# EAGLE design X15-ESC-CONTROLLER (EAGLE 9.6.2)
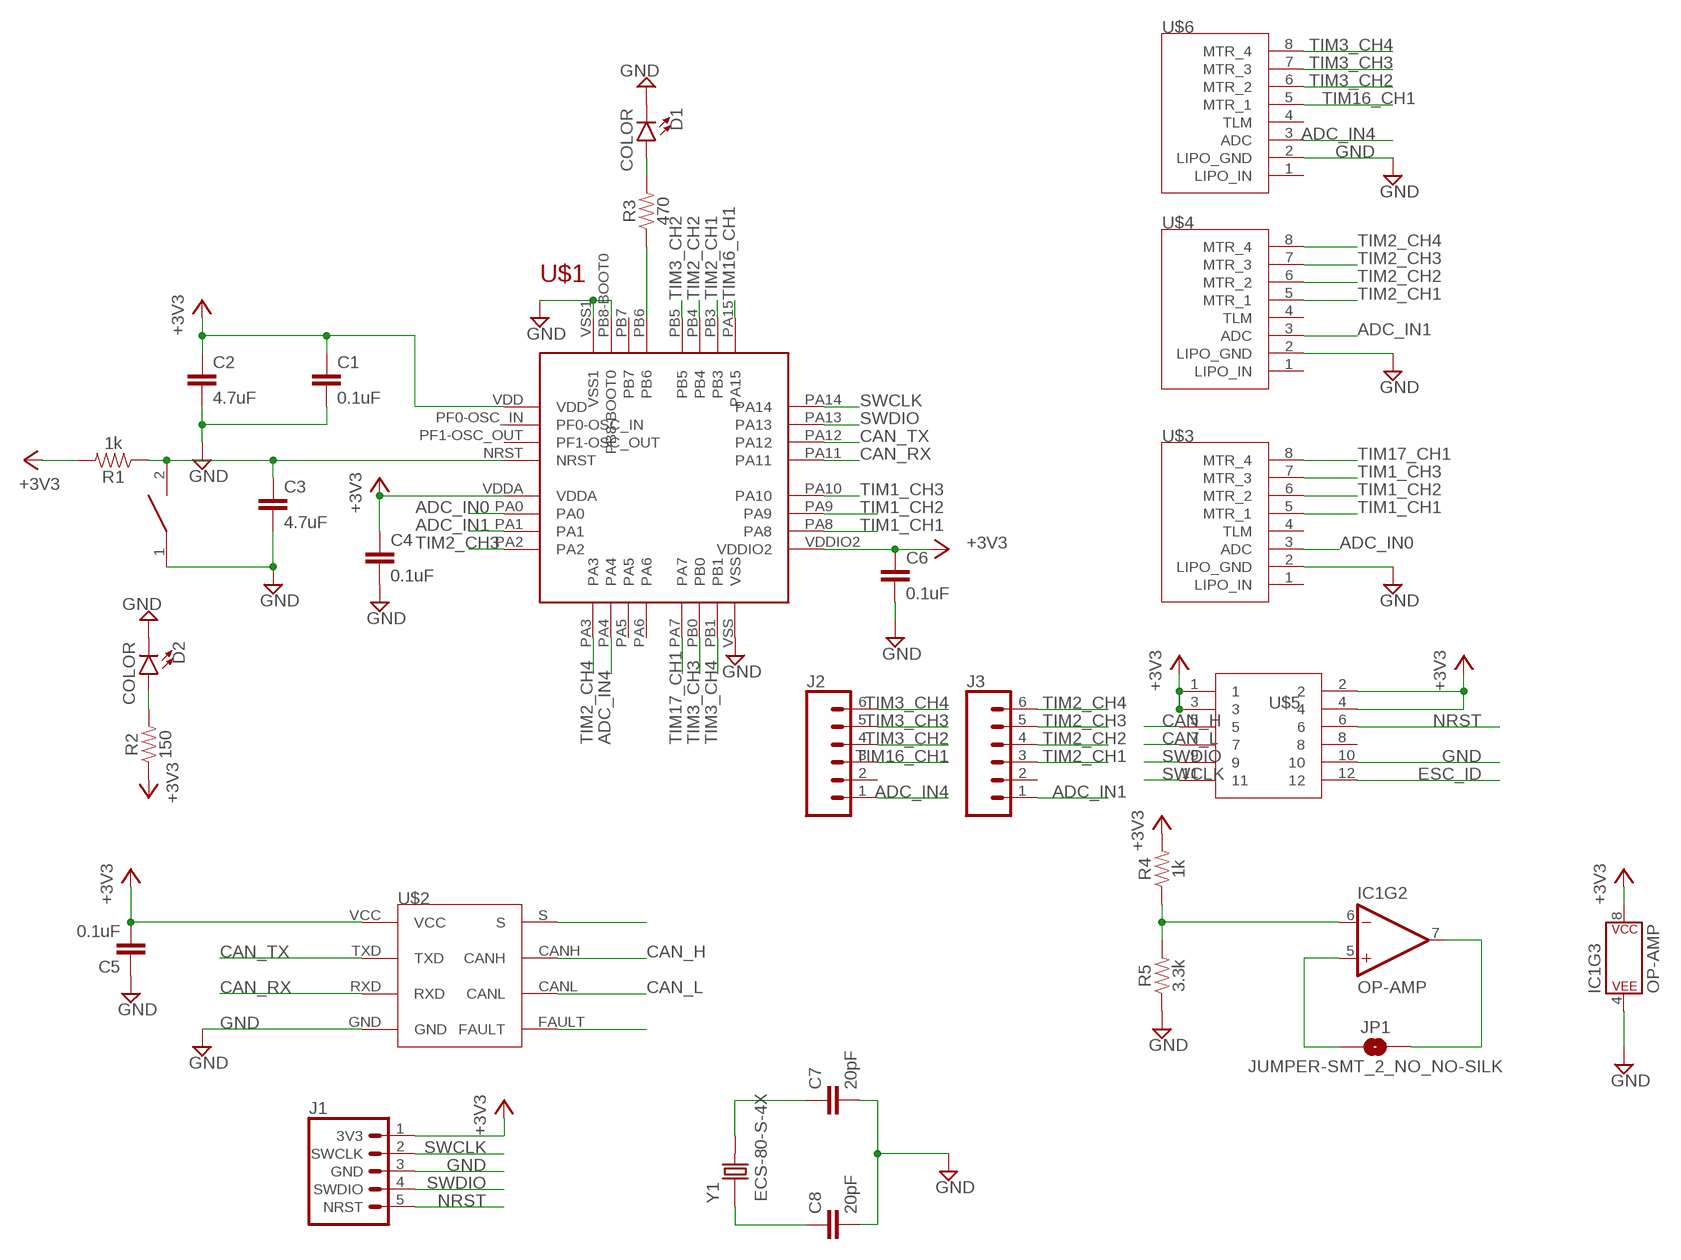
[diagram p0: schematic, sheet 1]

## Parts
C1  0.1uF  0.1UF-0603-25V-5%  [0603]
C2  4.7uF  4.7UF-0603-6.3V-(10%)  [0603]
C3  4.7uF  4.7UF-0603-6.3V-(10%)  [0603]
C4  0.1uF  0.1UF-0603-50V-10%-X7R-WE  [0603]
C5  0.1uF  0.1UF-0603-25V-(+80/-20%)  [0603]
C6  0.1uF  0.1UF-0603-25V-(+80/-20%)  [0603]
C7  20pF  20PF-0402T-50V-5%  [0402-TIGHT]
C8  20pF  20PF-0402T-50V-5%  [0402-TIGHT]
D1  COLOR  LED-0805  [0805]
D2  COLOR  LED-0805  [0805]
IC1  OP-AMP  OPAMP-DUALU  [SO08]
J1  3V3 -SWCLK-GND-SWDIO- NRST  SWD_CONN  [1X05]
J2  CONN_06NO_SILK_NO_POP  [1X06_NO_SILK]
J3  CONN_06NO_SILK_NO_POP  [1X06_NO_SILK]
JP1  JUMPER-SMT_2_NO_NO-SILK  [SMT-JUMPER_2_NO_NO-SILK]
R1  1k  1KOHM-0603-1/10W-1%  [0603]
R2  150  1KOHM-0603-1/10W-1%  [0603]
R3  470  10KOHM-0603-1/10W-1%  [0603]
R4  1k  1KOHM-0603-1/10W-1%  [0603]
R5  3.3k  1KOHM-0603-1/10W-1%  [0603]
U$1  STM32F042K6T6  [STM32F042K6T6]
U$2  TCAN337D  [TCAN337D]
U$3  JST_8_PIN  [8PIN_CONNECTOR]
U$4  JST_8_PIN  [8PIN_CONNECTOR]
U$5  BAKCPLANE_CONNECTOR  [BACKPLANE_CONNECTORS_BKP]
U$6  JST_8_PIN  [8PIN_CONNECTOR]
U$7  DISCRETECOMPONENTS_SWITCH  [DISCRETECOMPONENTS_SW_2512]
Y1  ECS-80-S-4X  [XTAL_ECS-80-S-4X]

## Nets
+3V3: C1.1 C2.1 C4.1 C5.2 C6.1 IC1.8(P$V+) J1.1(3V3) R1.2 R2.1 R4.2 U$1.VDD U$1.VDDA U$1.VDDIO2 U$2.VCC U$5.1 U$5.2 U$5.3 U$5.4
ADC_IN0: U$1.PA0 U$3.3(ADC)
ADC_IN1: J3.1 U$1.PA1 U$4.3(ADC)
ADC_IN4: J2.1 U$1.PA4 U$6.3(ADC)
CAN_H: U$2.CANH U$5.5
CAN_L: U$2.CANL U$5.7
CAN_RX: U$1.PA11 U$2.RXD
CAN_TX: U$1.PA12 U$2.TXD
ESC_ID: U$5.12
GND: C1.2 C2.2 C3.2 C4.2 C5.1 C6.2 C7.2 C8.2 D1.C D2.C IC1.4(P$V-) J1.3(GND) R5.1 U$1.PB8-BOOT0 U$1.VSS U$1.VSS1 U$2.GND U$3.2(LIPO_GND) U$4.2(LIPO_GND) U$5.10 U$6.2(LIPO_GND) U$7.1
N$1: D2.A R2.2
N$2: C3.1 R1.1 U$1.NRST U$7.2
N$3: IC1.6(-IN) R4.1 R5.2
N$4: R3.1 U$1.PB6
N$5: IC1.5(+IN) JP1.1
N$6: C7.1 Y1.2
N$7: C8.1 Y1.1
N$8: D1.A R3.2
N$9: U$2.S
N$10: IC1.7(OUT) JP1.2
N$12: U$2.FAULT
NRST: J1.5(NRST) U$5.6
SWCLK: J1.2(SWCLK) U$1.PA14 U$5.11
SWDIO: J1.4(SWDIO) U$1.PA13 U$5.9
TIM1_CH1: U$1.PA8 U$3.5(MTR_1)
TIM1_CH2: U$1.PA9 U$3.6(MTR_2)
TIM1_CH3: U$1.PA10 U$3.7(MTR_3)
TIM2_CH1: J3.3 U$1.PB3 U$4.5(MTR_1)
TIM2_CH2: J3.4 U$1.PB4 U$4.6(MTR_2)
TIM2_CH3: J3.5 U$1.PA2 U$4.7(MTR_3)
TIM2_CH4: J3.6 U$1.PA3 U$4.8(MTR_4)
TIM3_CH2: J2.4 U$1.PB5 U$6.6(MTR_2)
TIM3_CH3: J2.5 U$1.PB0 U$6.7(MTR_3)
TIM3_CH4: J2.6 U$1.PB1 U$6.8(MTR_4)
TIM16_CH1: J2.3 U$1.PA15 U$6.5(MTR_1)
TIM17_CH1: U$1.PA7 U$3.8(MTR_4)
Unconnected: IC1.1(OUT) IC1.2(-IN) IC1.3(+IN) J2.2 J3.2 U$1.PA5 U$1.PA6 U$1.PB7 U$1.PF0-OSC_IN U$1.PF1-OSC_OUT U$3.1(LIPO_IN) U$3.4(TLM) U$4.1(LIPO_IN) U$4.4(TLM) U$5.8 U$6.1(LIPO_IN) U$6.4(TLM)

## Library data of the parts
C1 = SparkFun-Capacitors:0.1UF: 0.1µF ceramic capacitors A capacitor is a passive two-terminal electrical component used to store electrical energy temporarily in an electric field.; PROD_ID: CAP-08604
C2 C3 = SparkFun-Capacitors:4.7UF: 4.7µF ceramic capacitors A capacitor is a passive two-terminal electrical component used to store electrical energy temporarily in an electric field.; PROD_ID: CAP-08280
C4 = SparkFun-Capacitors:0.1UF: 0.1µF ceramic capacitors A capacitor is a passive two-terminal electrical component used to store electrical energy temporarily in an electric field.; PROD_ID: CAP-16523
C5 C6 = SparkFun-Capacitors:0.1UF: 0.1µF ceramic capacitors A capacitor is a passive two-terminal electrical component used to store electrical energy temporarily in an electric field.; PROD_ID: CAP-00810
C7 C8 = SparkFun-Capacitors:20PF: 20pF ceramic capacitors A capacitor is a passive two-terminal electrical component used to store electrical energy temporarily in an electric field.; PROD_ID: CAP-14843
D1 D2 = LED, 0805:LED-0805
IC1 = SparkFun-IC-Amplifiers:OPAMP-DUAL: Generic op-amp footprint This component is for the standard 358 pinning of a dual op-amp From the LM358 datasheet: Pin 1: Output A Pin 2: Inverting Input A Pin 3: Non-Inverting Input A Pin 4: Gnd Pin 5: Non-Inverting Input B Pin 6: Inverting Input B Pin 7: Output B Pin 8: V+; PROD_ID: NA-XXXXX
J1 = X15-ESC-Controller-Parts-Library:SWD_CONN
J2 J3 = SparkFun-Connectors:CONN_06: Multi connection point. Often used as Generic Header-pin footprint for 0.1 inch spaced/style header connections On any of the 0.1 inch spaced packages, you can populate with these: Break Away Headers - Straight <https://www.sparkfun.com/products/116> (PRT-00116) Break Away Male Headers - Right Angle <https://www.sparkfun.com/products/553> (PRT-00553) Female Headers <https://www.sparkfun.com/products/115> (PRT-00115) Break Away Headers - Machine Pin <https://www.sparkfun.com/products/117> (PRT-00117) Break Away Female Headers - Swiss Machine Pin <https://www.sparkfun.com/products/743> (PRT-00743) Arduino Stackable Header - 6 Pin <https://www.sparkfun.com/products/9280> (PRT-09280) Screw Terminals 2.54mm Pitch (6-Pin) <https://www.sparkfun.com/products/16499> (PRT-16499) For SCREWTERMINALS and SPRING TERMINALS visit here: Screw Terimnals on SparkFun.com <https://www.sparkfun.com/search/results?term=Screw+Terminals> (5mm/3.5mm/2.54mm spacing) This device is also useful as a general connection point to wire up your design to another part of your project. Our various solder wires solder well into these plated through hole pads. Hook-Up Wire - Assortment (Stranded, 22 AWG) <https://www.sparkfun.com/products/11375> (PRT-11375) Hook-Up Wire - Assortment (Solid Core, 22 AWG) <https://www.sparkfun.com/products/11367> (PRT-11367) View the entire wire category on our website here <https://www.sparkfun.com/categories/141>
JP1 = SparkFun-Jumpers:JUMPER-SMT_2_NO: Normally open jumper This jumper has two pads in close proximity to each other. Apply solder to close the connection. Round pads are easier to solder for beginners, but are a lot larger. SparkFun Product that uses the round pads: SparkFun EL Sequencer <https://www.sparkfun.com/products/12781>
R1 R4 = SparkFun-Resistors:1KOHM: 1kΩ resistor A resistor is a passive two-terminal electrical component that implements electrical resistance as a circuit element. Resistors act to reduce current flow, and, at the same time, act to lower voltage levels within circuits. - Wikipedia; PROD_ID: RES-07856
R2 R5 = SparkFun-Resistors:1KOHM: 1kΩ resistor A resistor is a passive two-terminal electrical component that implements electrical resistance as a circuit element. Resistors act to reduce current flow, and, at the same time, act to lower voltage levels within circuits. - Wikipedia; PROD_ID: RES-07856; VALUE: 1k
R3 = SparkFun-Resistors:10KOHM: 10kΩ resistor A resistor is a passive two-terminal electrical component that implements electrical resistance as a circuit element. Resistors act to reduce current flow, and, at the same time, act to lower voltage levels within circuits. - Wikipedia; PROD_ID: RES-00824; VALUE: 10k
U$1 = X15-ESC-Controller-Parts-Library:STM32F042K6T6
U$2 = X15-ESC-Controller-Parts-Library:TCAN337D
U$3 U$4 U$6 = X15-Parts-Library:JST_8_PIN
U$5 = X15-ESC-Controller-Parts-Library:BAKCPLANE_CONNECTOR
U$7 = OTHER, Push button - FSM2JMTR:DISCRETECOMPONENTS_SWITCH: TE Connectivity FSM2JMTR Switch
Y1 = X15-ESC-Controller-Parts-Library:ECS-80-S-4X: CRYSTAL T/H; DESCRIPTION: Crystal 8MHz Series 2-Pin HC-49/U; DIGI-KEY_PART_NUMBER: X1057-ND; DIGI-KEY_PURCHASE_URL: https://www.digikey.com/product-detail/en/ecs-inc/ECS-80-S-4X/X1057-ND/827549?utm_source=snapeda&utm_medium=aggregator&utm_campaign=symbol; MF: ECS International; MP: ECS-80-S-4X; PACKAGE: HC-49/US ECS International

## Board
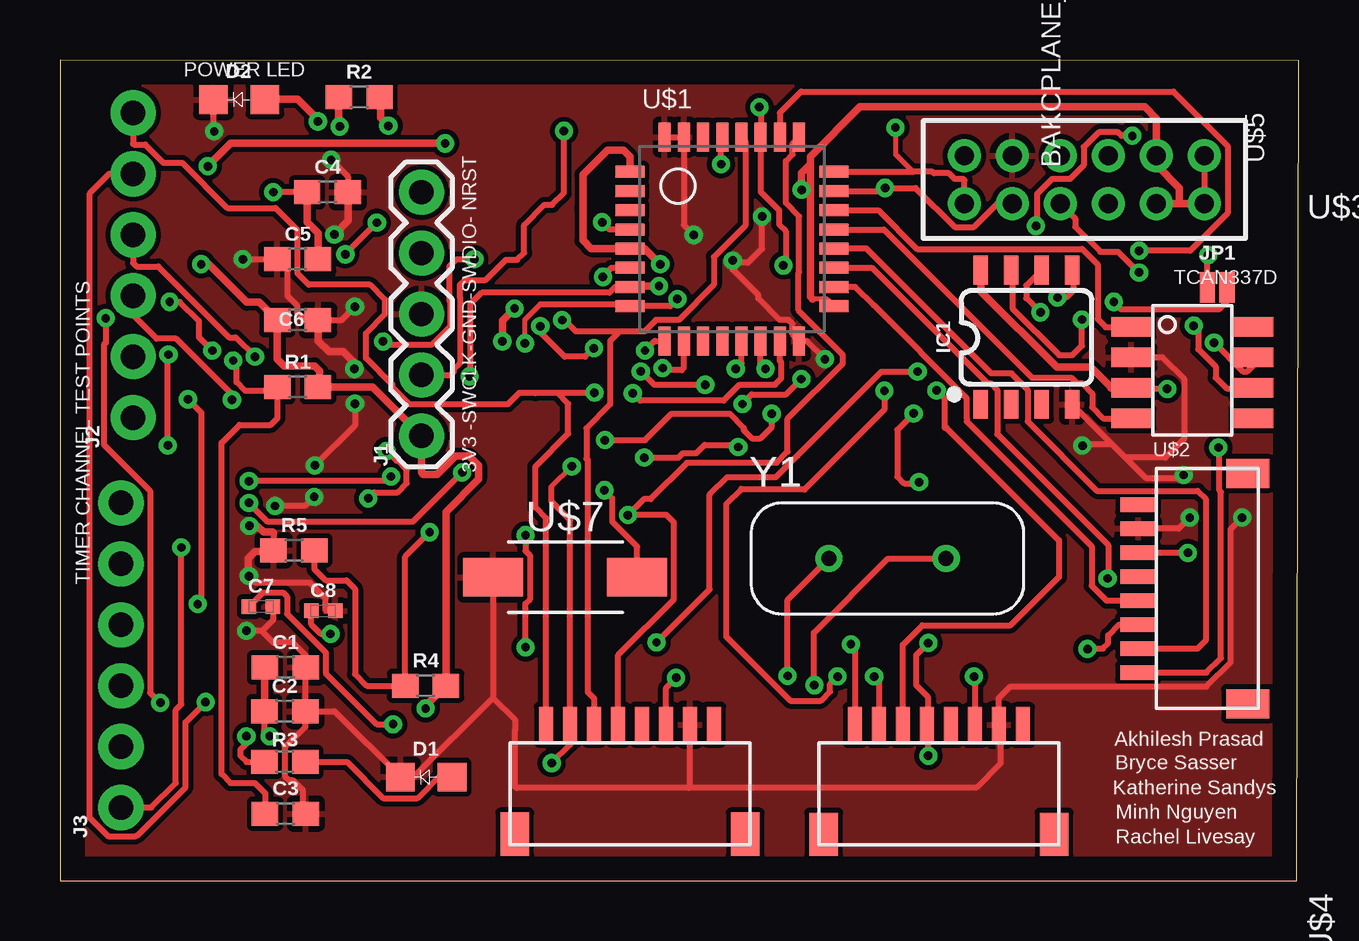
[diagram p1: board, top side]
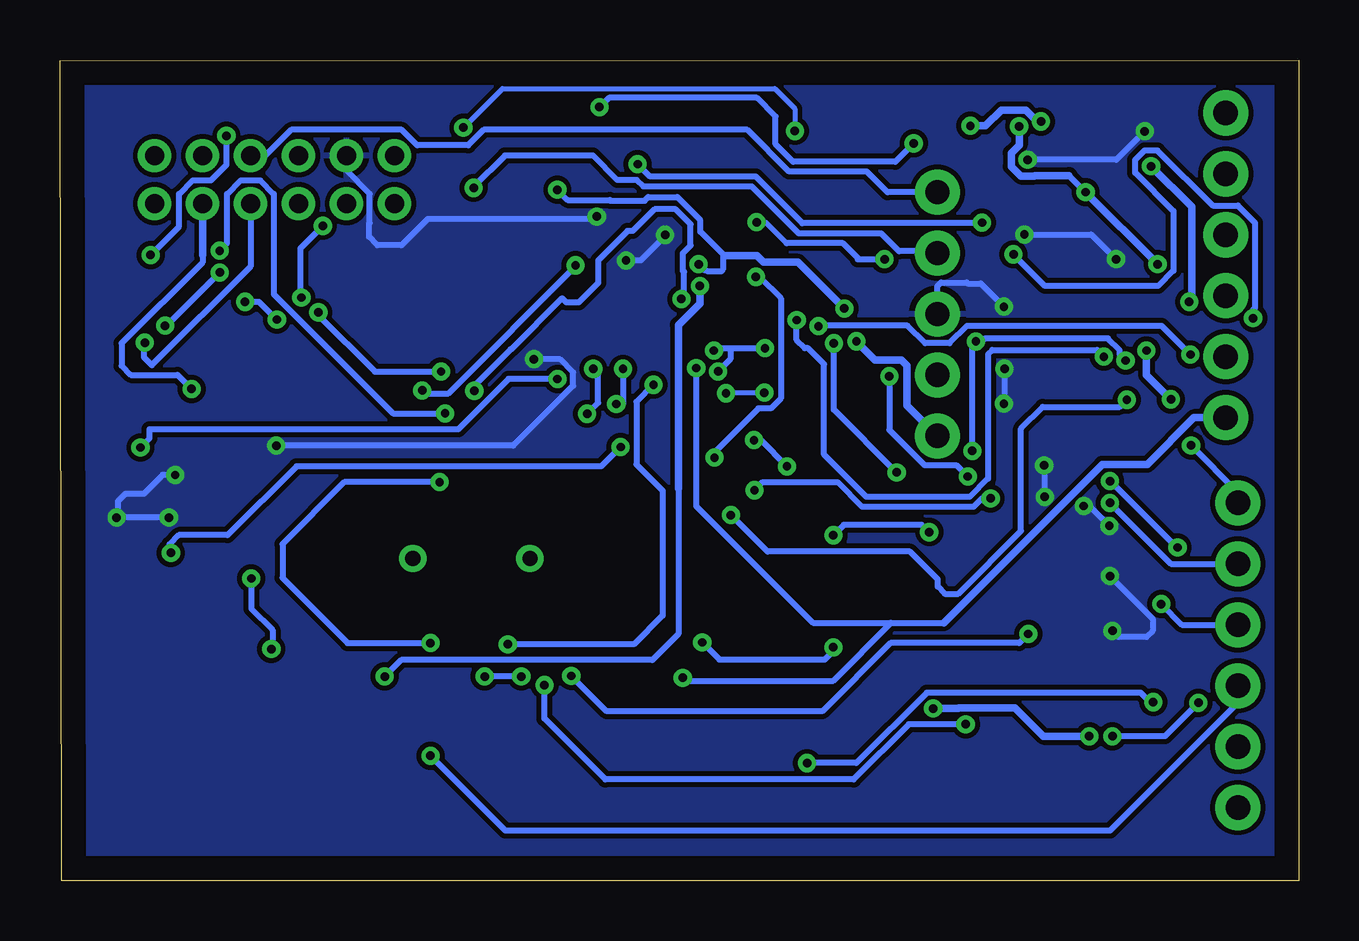
[diagram p2: board, bottom side, seen from below]

Size 51.64 x 34.21 mm. Coordinates in mm from the lower left corner, seen from the top.
Outline: 0,0 51.56,0 51.64,34.19 0,34.21 0,0
Copper layers (1*16): Top 0.035mm / dielectric 1.5mm / Bottom 0.035mm
Design rules "477": minimum track width 6mil, minimum drill 0.35mm, track to track 6mil, track to pad 6mil, pad to pad 6mil, via to via 6mil, smd to smd 6mil, copper to edge 40mil, drill to drill 6mil, minimum pad ring 10mil, minimum via ring 8mil, stop-mask expansion 4mil, vias tented up to drill 0mil, thermal gap 10mil

### Footprints (pad centres in the part's own frame; a part is rotated, then mirrored left to right if it is on the bottom)
0603 = smd 1.1 x 1: 1 -0.85,0; 2 0.85,0
0402-TIGHT = smd 0.6 x 0.6: 1 -0.5,0; 2 0.5,0
0805 = smd 1.2 x 1.2: A 1.1,0; C -1.05,0
SO08 = smd 0.6 x 1.2: 1 -1.905,-2.8; 2 -0.635,-2.8; 3 0.635,-2.8; 4 1.905,-2.8; 5 1.905,2.8; 6 0.635,2.8; 7 -0.635,2.8; 8 -1.905,2.8
1X05 = drill 1.016 pad 1.88: 1 0,0; 2 2.54,0; 3 5.08,0; 4 7.62,0; 5 10.16,0
1X06_NO_SILK = drill 1.016 pad 1.88: 1 0,0; 2 2.54,0; 3 5.08,0; 4 7.62,0; 5 10.16,0; 6 12.7,0
SMT-JUMPER_2_NO_NO-SILK = smd 0.635 x 1.27: 1 -0.406,0; 2 0.406,0
STM32F042K6T6 = smd 1.2 x 0.5: NRST 0,3.2; PA0 0,1.6; PA1 0,0.8; PA2 0,0; PA8 8.5,0.8; PA9 8.5,1.6; PA10 8.5,2.4; PA11 8.5,3.2; PA12 8.5,4; PA13 8.5,4.8; PA14 8.5,5.6; PF0-OSC_IN 0,4.8; PF1-OSC_OUT 0,4; VDD 0,5.6; VDDA 0,2.4; VDDIO2 8.5,0 | smd 0.5 x 1.2: PA3 1.45,-1.45; PA4 2.25,-1.45; PA5 3.05,-1.45; PA6 3.85,-1.45; PA7 4.65,-1.45; PA15 7.05,7.05; PB0 5.45,-1.45; PB1 6.25,-1.45; PB3 6.25,7.05; PB4 5.45,7.05; PB5 4.65,7.05; PB6 3.85,7.05; PB7 3.05,7.05; PB8-BOOT0 2.25,7.05; VSS 7.05,-1.45; VSS1 1.45,7.05
TCAN337D = smd 1.676 x 0.813: CANH 5.08,-1.27; CANL 5.08,-2.54; FAULT 5.08,-3.81; GND 0,-1.27; RXD 0,-3.81; S 5.08,0; TXD 0,0; VCC 0,-2.54
8PIN_CONNECTOR = smd 1.5 x 0.6: 1 4.56,1.5; 2 4.56,2.5; 3 4.56,3.5; 4 4.56,4.5; 5 4.56,5.5; 6 4.56,6.5; 7 4.56,7.5; 8 4.56,8.5 | smd 1.8 x 1.2: MECH1 0,0.2; MECH2 0,9.8
BACKPLANE_CONNECTORS_BKP = drill 0.79 pad 1.39: 1 -1,-5; 2 1,-5; 3 -1,-3; 4 1,-3; 5 -1,-1; 6 1,-1; 7 -1,1; 8 1,1; 9 -1,3; 10 1,3; 11 -1,5; 12 1,5
DISCRETECOMPONENTS_SW_2512 = smd 2.5 x 1.6: 1 -3,0; 2 3,0
XTAL_ECS-80-S-4X = drill 0.63 pad 1.03: 1 -2.44,0; 2 2.44,0

### Placement (x,y rotation side)
C1  9.4,8.89 0 top
C2  9.37,7.06 0 top
C3  9.4,2.79 0 top
C4  11.15,28.7 0 top
C5  9.91,25.91 0 top
C6  9.91,23.37 0 top
C7  8.38,11.43 0 top
C8  10.97,11.25 0 top
D1  15.24,4.32 0 top
D2  7.44,32.56 0 top
IC1  40.28,22.66 0 top
J1  15.07,18.54 90 top
J2  3.05,19.3 90 top
J3  2.54,3.05 90 top
JP1  48.23,24.74 0 top
R1  9.91,20.57 0 top
R2  12.47,32.66 0 top
R3  9.37,4.95 0 top
R4  15.24,8.13 0 top
R5  9.75,13.77 0 top
U$1  23.76,23.95 0 top
U$2  44.65,23.08 0 top
U$3  49.5,17.17 180 top
U$4  41.63,1.93 90 top
U$5  42.7,29.23 90 top
U$6  28.76,1.94 90 top
U$7  21.06,12.65 0 top
Y1  34.49,13.43 0 top

### Tracks (layer width: path | path; a pad name or v marks a point on that pad's centre or on a via)
+3V3  (via drill 0.35)
  Top 0.203: U$1.VDDIO2 31.96,24.25 31.38,24.25
  Top 0.254: 43.79,20.54 43.79,20.57 | v46.15,20.5 44.7,20.5 U$2.VCC | 8.52,6.24 8.52,7.29 | U$5.2 U$5.1 | C4.1 v8.89,28.7
  Top 0.305: 31.38,24.25 31.28,24.34 31.28,29.86 | 31.28,29.86 31.28,30.18 33.35,32.26 45.21,32.26 45.7,31.77 U$5.4 45.7,29.84 46.66,28.88 46.66,28.23 | U$5.3 46.66,28.23 | 46.66,28.23 U$5.1 | v5.88,25.7 6.2,25.7 7.79,24.11 8.31,24.11 C6.1 9.06,21.74 9.34,21.46 10.61,21.46 10.82,21.25 10.82,20.57 | C1.1 8.52,8.87 8.52,7.29 C2.1 | 43.79,20.54 U$2.VCC | IC1.8 38.38,24.57 41.55,21.4 42.97,21.4 43.79,20.58 43.79,20.57 | v18.44,22.48 18.44,23.35 v18.95,23.85 | v15.24,7.18 15.24,7.28 R4.2 16.09,15.38 17.45,16.73 17.45,17.3 17.05,17.7 16.48,17.7 15.72,16.94 15.14,16.94 15.07,17.01 J1.1 13.04,20.57 10.82,20.57 | R1.2 10.82,20.57 | 8.52,6.24 v8.74,6.02 | C4.1 10.3,27.44 10.76,26.99 C5.2 | R2.1 11.62,31.48 v11.66,31.45 | v30.91,28.8 30.91,29.5 31.28,29.86 | v25.02,25.7 24.37,26.35 U$1.VDDA 22.14,26.35 21.79,26.7 21.79,27.96 21.79,28.07 21.79,29.43 22.81,30.45 23.48,30.45 23.76,30.17 U$1.VDD
  Bottom 0.254: 23.95,26.06 24,26.11 | 24,26.11 24.95,27.05 24.95,27.53 25.91,28.5 27.12,28.5 27.27,28.35 28.7,28.35 28.72,28.37 30.48,28.37 v30.91,28.8 | 24,26.11 24,25.48 24.08,25.4 24.65,25.4 24.7,25.45 24.77,25.45 v25.02,25.7 | 45.7,26.09 45.7,25.77 49.07,22.4 49.07,21.47 48.68,21.09 46.74,21.09 v46.15,20.5 | 9.58,29.4 v8.89,28.7
  Bottom 0.305: U$5.3 45.7,26.09 | v5.88,25.7 v8.89,28.7 | J1.1 16.34,19.81 16.34,21.48 16.57,21.71 17.67,21.71 v18.44,22.48 | v18.95,23.85 20.87,25.78 22.31,25.78 22.59,26.06 23.95,26.06 | v15.24,7.18 14.19,7.18 14.17,7.2 11.83,7.2 10.64,6.02 v8.74,6.02 | v11.66,31.45 11.66,30.66 11.99,30.34 11.99,29.77 11.59,29.37 11.02,29.37 10.99,29.4 9.58,29.4
ADC_IN0  (via drill 0.35)
  Top 0.254: v22.63,25.17 22.62,25.18 22.98,25.55 U$1.PA0 | v47.02,13.66 44.95,13.66 U$3.3 | v24.36,17.63 25.77,17.63 25.97,17.83 26.53,17.83 26.87,18.17 28.18,18.17 v28.27,18.08
  Bottom 0.254: v22.63,25.17 22.48,25.17 21.59,24.28 21.59,20.1 22.01,19.69 22.53,19.69 24.36,17.86 v24.36,17.63 | v28.27,18.08 29.08,17.27 41.78,17.27 44.65,14.4 46.69,14.4 47.07,14.02 47.07,13.72 v47.02,13.66
ADC_IN1  (via drill 0.35)
  Top 0.254: v17.07,21.03 17.12,21.08 17.12,24.06 17.58,24.51 22.9,24.51 23.14,24.75 U$1.PA1 | v7.87,16.66 13.61,16.66 v13.8,16.85 | v38.1,8.51 38.13,8.47 U$4.3 | v5.05,13.89 5.05,7.36 4.83,7.13 4.83,4.06 3.81,3.05 J3.1
  Top 0.305: v24.97,24.79 23.8,24.79 U$1.PA1
  Bottom 0.254: v17.07,21.03 17.07,18.8 15.6,17.32 14.28,17.32 v13.8,16.85 | v7.87,16.66 7.62,16.41 7.6,16.41 5.09,13.89 v5.05,13.89 | 25.86,16.35 25.86,10.28 26.95,9.2 37.41,9.2 v38.1,8.51
  Bottom 0.305: v24.97,24.79 24.97,24.05 25.86,23.16 25.86,16.35
ADC_IN4  (via drill 0.35)
  Top 0.254: U$6.3 25.26,8.04 v25.68,8.46 | v25.12,21.37 25.2,21.29 25.91,21.29 26.01,21.39 U$1.PA4
  Bottom 0.254: 17.02,10.75 20.25,10.75 25.12,15.61 v25.12,21.37 | 17.02,10.75 14.8,10.75 | v25.68,8.46 25.55,8.33 19.41,8.33 17.02,10.72 17.02,10.75
  Bottom 0.305: J2.1 4.37,19.3 6.32,17.35 8.2,17.35 14.8,10.75
CAN_H  (via drill 0.35)
  Top 0.254: v48.1,22.43 49.3,21.23 49.48,21.23 49.73,21.48 U$2.CANH
  Bottom 0.254: U$5.5 43.7,25.6 47.81,21.49 48.13,21.81 48.13,22.4 v48.1,22.43
CAN_L  (via drill 0.35)
  Top 0.254: U$2.CANL 49.71,20.52 48.63,20.52 48.17,20.97 48.17,21.43 47.45,22.16 47.45,22.95 v47.26,23.14 | U$5.7 42.32,27.6 42.32,27.25 43.36,26.22 44.1,26.22 44.33,25.99 44.71,25.61 44.73,25.61 v44.98,25.36
  Bottom 0.254: v44.98,25.36 47.19,23.14 v47.26,23.14
CAN_RX
  Top 0.254: U$1.PA11 34.34,27.15 40.52,20.97 42.15,20.97 42.38,20.74 42.6,20.74 43.03,20.31 43.03,19.74 43.49,19.27 U$2.RXD
CAN_TX
  Top 0.254: U$1.PA12 34.11,27.95 35.73,26.34 42.6,26.34 43.26,25.69 43.26,23.41 43.59,23.08 U$2.TXD
GND  (via drill 0.35)
  Top 0.254: C2.2 11.45,7.06 D1.C 14.74,4.32 18.06,7.63 | C2.2 10.22,8.87 C1.2 10.25,9.39 9.7,9.93 8.89,9.93 8.43,10.39 8.43,10.41 | C8.2 11.08,11.25 11.08,11.77 10.43,12.42 8.16,12.42 v7.87,12.7 | v7.62,25.91 C5.1 9.48,25.48 9.48,24.39 9.88,23.98 9.88,23.7 10.07,23.51 10.61,23.51 C6.2 | v28.04,25.86 28.04,25.76 | 28.04,25.76 28.04,25.46 29.11,24.4 29.11,24.27 30,23.38 30.37,23.38 30.54,23.22 30.54,22.77 U$1.VSS 31.12,22.5 v31.88,21.74 | C2.2 10.22,6.4 9.39,5.57 9.39,4.34 9.56,4.17 9.72,4.17 10.13,3.76 10.13,2.91 C3.2 | v12.29,19.89 12.29,18.97 10.62,17.3 v10.62,17.31 | v10.59,16 10.21,15.62 v8.96,15.62 | 28.04,25.76 28.68,25.76 29.26,26.34 v29.26,27.69 | U$1.VSS1 U$1.PB8-BOOT0 26.01,27.33 v26.42,26.92 | 7.9,14.77 v7.9,14.79 | IC1.4 43.83,18.21 | U$2.GND 45.95,21.81 46.86,20.9 46.86,18.43 46.08,17.64 44.41,17.64 | U$7.1 18.06,7.63 | 26.25,3.9 26.21,3.86 19.03,3.86 18.97,3.93 18.97,6.27 18.98,6.29 18.98,6.7 18.06,7.63 | 26.25,3.9 26.26,3.91 U$6.2 | 26.25,3.9 38.21,3.9 39.22,4.9 39.22,6.41 U$4.2 39.13,7.61 39.62,8.1 47.79,8.1 48.79,9.1 48.79,14.66 v49.28,15.14 | v42.62,18.14 42.7,18.21 43.83,18.21 | 43.83,18.21 44.41,17.64 | 44.41,17.64 45.26,16.79 46.72,16.79 v46.84,16.91 | v47.09,15.14 46.63,14.68 U$3.2 | C7.2 8.88,10.86 8.43,10.41 | 8.43,10.41 v7.77,10.41 | D2.C 6.39,31.28 v6.43,31.24 | v11.3,30.05 12,29.36 C4.2 | 8.9,14.49 R5.1 | 10.77,23.35 11.72,23.35 v12.29,23.93
  Top 0.305: C4.2 12,27.55 12.01,27.53 12.01,27.51 v11.44,26.94 | C6.2 10.77,23.35 10.77,22.5 11.23,22.05 11.81,22.05 12.27,21.59 v12.27,21.34 | 8.9,14.49 8.87,14.53 8.48,14.53 8.24,14.77 7.9,14.77 | R5.1 8.85,13.72 8.13,13.72 7.85,13.44 7.85,12.72 v7.87,12.7
  Bottom 0.254: v7.77,10.41 7.52,10.16 6.35,10.16 6.1,10.41 6.1,10.92 v7.87,12.7 | v11.44,26.94 8.65,26.94 v7.62,25.91 | v12.27,21.34 12.27,19.91 v12.29,19.89 | v10.62,17.31 10.62,16.02 v10.59,16 | v28.04,25.86 27.43,25.86 26.42,26.87 v26.42,26.92 | v12.29,23.93 13.26,24.89 13.8,24.89 13.85,24.94 14.91,24.94 15.07,24.79 J1.3 | v8.96,15.62 8.72,15.62 v7.9,14.79 | v42.62,18.14 32.75,18.14 30.25,20.64 30.25,21.18 30.8,21.74 v31.88,21.74 | U$5.10 39.7,29.6 38.72,28.63 38.72,27.43 38.76,27.39 38.76,26.84 38.41,26.5 37.4,26.5 36.31,27.58 29.37,27.58 v29.26,27.69 | v6.43,31.24 7.61,30.05 v11.3,30.05 | v47.09,15.14 49.23,15.14 | 49.23,15.14 v49.28,15.14 | v46.84,16.91 47.36,16.91 48.15,16.12 48.92,16.12 49.23,15.81 49.23,15.14
  pour Top (isolate 0.203): -2.03,35.56 -2.03,-2.29 53.85,-2.29 53.85,35.81 -2.03,35.81
  pour Bottom (isolate 0.203): -2.03,35.81 -2.03,-2.29 53.85,-2.29 53.85,35.81
N$1  (via drill 0.35)
  Top 0.305: D2.A 8.57,32.59 9.91,32.59 10.75,31.74 v10.75,31.65 | v13.69,31.47 13.36,31.8 13.36,32.62 R2.2
  Bottom 0.305: v10.75,31.65 10.9,31.65 11.38,32.13 12.4,32.13 13.06,31.47 v13.69,31.47
N$2  (via drill 0.35)
  Top 0.254: v7.22,21.68 7.36,21.68 7.36,20.78 7.72,20.42 8.9,20.42 8.99,20.5 | U$1.NRST 22.9,27.15 v22.6,27.45 | v13.46,22.48 13.59,22.35 15.52,22.35 16.29,23.12 16.29,24.13 16.23,24.18 16.23,25.6 16.29,25.66 16.54,25.91 v17.27,25.91 | U$7.2 24.06,13.93 23.02,14.97 23.02,15.95 v22.69,16.28 | v12.85,15.94 13.1,16.19 14.07,16.19 14.46,16.58 14.46,17.12 14.07,17.51 14.02,17.51 v13.61,17.92 | R1.1 8.99,20.5 | 8.99,20.5 9.07,20.42 9.07,19.28 8.79,19 7.48,19 6.73,18.25 6.73,4.45 7.11,4.06 8.13,4.06 8.56,3.63 8.56,2.81 C3.1
  Bottom 0.203: v22.6,27.45 22.23,27.45 21.38,26.59
  Bottom 0.254: v7.22,21.68 7.47,21.93 7.47,22.12 7.96,22.61 13.08,22.61 13.21,22.48 v13.46,22.48 13.61,22.33 v13.61,17.92 | v17.27,25.91 18.38,25.91 18.38,25.95 19,26.57 21.35,26.57 21.38,26.59 | v22.69,16.28 22.35,16.61 19.22,16.61 18.2,15.6 13.55,15.6 13.21,15.94 v12.85,15.94
N$3  (via drill 0.35)
  Top 0.254: v15.41,14.53 14.39,13.51 R4.1 12.79,8.13 12.3,8.62 12.3,12.16 11.94,12.52 11.07,12.52 10.6,12.99 R5.2 | IC1.6 40.28,24.82 40.28,24.28 v40.87,23.69 | v35.75,21.22 34.24,21.22 30.74,17.73 30.74,17.72 29.84,16.82 27.81,16.82 27.08,16.09 27.08,12.15 v24.87,9.93 | v19.41,9.73 19.41,11.55 19.59,11.73 19.59,13.56 19.41,13.74 v19.41,14.4
  Bottom 0.254: v15.41,14.53 15.71,14.83 18.97,14.83 v19.41,14.4 | v40.87,23.69 40.87,23.59 38.51,21.22 v35.75,21.22 | v24.87,9.93 24.16,9.22 19.76,9.22 19.41,9.58 v19.41,9.73
N$4  (via drill 0.35)
  Top 0.254: v1.91,23.45 1.91,22.43 1.83,22.35 1.83,18.18 3.76,16.25 3.76,7.84 v4.18,7.42 | v13.21,27.43 v11.89,26.12 v11.89,26.11 | v27.56,29.87 27.56,30.95 U$1.PB6 | v7.77,6.02 7.77,5.71 7.52,5.46 7.52,5.21 7.77,4.95 R3.1
  Bottom 0.254: v13.21,27.43 13.23,27.41 20.7,27.41 22.64,29.35 27.04,29.35 v27.56,29.87 | v1.91,23.45 1.91,23.8 1.83,23.88 1.83,27.43 2.54,28.14 3.59,28.14 5.89,30.44 6.43,30.44 6.82,30.06 6.82,29.51 5.23,27.92 5.23,25.43 5.86,24.79 10.58,24.79 v11.89,26.11 | v4.18,7.42 5.58,6.02 v7.77,6.02
N$5  (via drill 0.35)
  Top 0.254: JP1.1 47.83,26.05 v47.86,26.08 | v40.68,27.3 40.72,27.34 40.72,28.63 41.35,29.25 42.1,29.25 42.67,29.82 42.67,30.58 43.29,31.2 44.1,31.2 44.25,31.05 v44.7,31.05 | v41.58,24.31 41.94,24.31 42.26,24.62 42.26,25.39 IC1.5
  Bottom 0.254: v47.86,26.08 46.67,27.27 46.67,28.63 46.1,29.2 45.35,29.2 44.7,29.85 v44.7,31.05 | v40.68,27.3 41.63,26.35 41.63,24.36 v41.58,24.31
N$6  (via drill 0.35)
  Top 0.254: v13.89,6.52 13.2,6.52 11.08,8.64 11.08,9.51 9.46,11.12 9.46,11.85 9.3,12.01 8.47,12.01 C7.1 | v31.45,8.15 31.42,8.18 31.42,10.34 34.51,13.43 Y1.2
  Bottom 0.254: v13.89,6.52 16.25,6.52 18.56,4.22 28.91,4.22 31.45,6.76 v31.45,8.15
N$7  (via drill 0.35)
  Top 0.254: v30.33,8.54 30.33,11.71 Y1.1 | v11.28,10.29 10.87,10.29 10.47,10.69 C8.1
  Bottom 0.254: v11.28,10.29 11.66,9.91 17.02,9.91 19.86,7.06 28.85,7.06 v30.33,8.54
N$8
  Top 0.254: D1.A 16.43,4.4 15.87,4.4 14.91,3.44 13.47,3.44 11.96,4.95 R3.2
N$10  (via drill 0.35)
  Top 0.254: IC1.7 39.71,25.4 39.71,23.85 41.65,21.9 42.2,21.9 42.6,22.3 v42.6,23.39 | JP1.2 48.64,24.16 48.29,23.81 48.27,23.82 44.23,23.82 v43.92,24.13
  Bottom 0.254: v42.6,23.39 43.34,24.13 v43.92,24.13
NRST
  Bottom 0.254: U$5.6 43.08,30.23 42,31.3 37.4,31.3 36.75,30.66 34.62,30.66 33.98,31.3 22.99,31.3 21.25,29.57 18.01,29.57 17.14,28.7 J1.5
SWCLK  (via drill 0.35)
  Top 0.203: 35.56,29.55 34.82,30.29 v34.82,31.4
  Top 0.254: U$1.PA14 35.56,29.55 36.37,29.55 36.44,29.49 37.06,29.49 37.29,29.25 37.64,29.25 37.7,29.2 U$5.11 | J1.2 16.28,21.08 16.41,21.21 16.41,21.3 16.69,21.58 16.69,24.3 16.66,24.32 16.66,24.84 16.87,25.04 17.75,25.04 18.59,25.88 19.06,25.88 19.35,26.17 19.35,27.34 20.18,28.18 20.52,28.18 21.01,28.66 v21.01,31.26
  Bottom 0.203: v34.82,31.4 33.2,33.02 21.84,33.02 21.01,32.18 v21.01,31.26
SWDIO  (via drill 0.35)
  Top 0.254: U$5.9 39.08,28.23 38.1,27.25 37.29,27.25 35.67,28.88 v34.39,28.88 34.26,28.75 U$1.PA13
  Bottom 0.254: J1.4 15.14,26.24 16.67,26.24 17.41,26.98 20.84,26.98 22.81,28.94 27.32,28.94 27.59,29.21 28.42,29.21 29.43,30.23 33.09,30.23 34.39,28.93 v34.39,28.88
TIM1_CH1
  Top 0.254: U$1.PA8 33.15,24.75 33.92,23.99 37.8,20.1 37.8,19.28 37.8,19.14 43,13.94 43,12.29 43.62,11.68 U$3.5
TIM1_CH2  (via drill 0.35)
  Top 0.254: U$1.PA9 33.84,25.55 38.65,20.74 38.8,20.74 39.07,20.46 39.07,18.61 43.69,13.99 43.69,12.62 v43.66,12.6 | v42.83,9.66 42.85,9.68 43.48,9.68 43.7,9.9 43.7,10.23 44.14,10.68 U$3.6
  Bottom 0.254: v43.66,12.6 43.66,11.33 42.78,10.45 42.78,9.71 v42.83,9.66
TIM1_CH3
  Top 0.254: U$3.7 47.42,9.68 47.75,10.01 47.75,15.91 47.41,16.25 43.23,16.25 40.34,19.14 40.34,20.46 39.66,21.14 38.82,21.14 33.61,26.35 U$1.PA10
TIM2_CH1  (via drill 0.35)
  Top 0.254: v36.2,5.21 36.2,6.33 36.22,6.35 36.22,6.41 U$4.5 36.17,6.53 36.17,7.67 35.69,8.15 35.69,9.4 v36.2,9.91 | v44.98,26.26 47.11,26.26 48.67,27.82 48.67,30.63 46.41,32.89 30.89,32.89 30.01,32.02 U$1.PB3 | v35.59,19.48 34.9,18.79 34.9,16.84 35.18,16.56 35.76,16.56 v35.81,16.61
  Bottom 0.254: J3.3 2.54,7.42 7.87,2.08 33.07,2.08 v36.2,5.21 | v35.59,19.48 37.76,19.48 42.72,24.45 42.72,28.63 43.29,29.2 44.1,29.2 44.67,28.63 44.67,26.57 v44.98,26.26 | v35.81,16.61 39.78,16.61 42.37,14.03 42.37,12.62 39.65,9.91 v36.2,9.91
TIM2_CH2  (via drill 0.35)
  Top 0.254: v30.15,25.65 30.25,25.76 30.25,27.08 29.97,27.36 29.97,27.95 29.21,28.71 U$1.PB4 29.21,32.19 v29.15,32.25 | v5.33,20.07 5.89,19.51 5.89,11.69 v5.74,11.53 | U$4.6 35.13,9.84 35.94,10.64 39.62,10.64 41.64,12.66 41.64,14.19 36.96,18.87 36.88,18.87 36.88,20.09 v36.54,20.43 | v6.35,22.1 5.8,22.65 5.8,23.33 5,24.13 v4.57,24.13
  Top 0.305: v6.16,29.78 7.12,30.74 v16.05,30.74
  Bottom 0.254: v16.05,30.74 16.82,29.97 21.08,29.97 21.81,30.7 21.81,31.86 22.59,32.64 28.76,32.64 v29.15,32.25 | v30.15,25.65 30.1,25.65 35.45,20.31 36.41,20.31 v36.54,20.43 | v5.74,11.53 4.87,10.67 J3.4
  Bottom 0.305: v6.16,29.78 4.47,28.09 4.47,24.11 4.5,24.13 v4.57,24.13 | v6.35,22.1 6.35,21.08 v5.33,20.07
TIM2_CH3  (via drill 0.35)
  Top 0.203: v19.38,22.4 19.38,23.39 20.01,24.03
  Top 0.254: v16.76,17.02 14.71,14.96 8.66,14.96 v7.87,15.75 | 20.01,24.03 23.68,24.03 U$1.PA2 25.44,23.95 v25.74,24.25 | v34.36,20.42 34.36,19.63 31.04,16.31 28.42,16.31 28.4,16.33 27.76,15.7 27.76,10.17 30.44,7.5 31.72,7.5 32.1,7.88 32.1,8.2 v32.41,8.51 | U$4.7 34.13,8.31 v33.93,8.51
  Bottom 0.254: v7.87,15.75 5.33,13.21 J3.5 | v25.74,24.25 25.63,24.36 25.63,25.38 25.68,25.43 25.68,26.16 25.35,26.48 25.35,27.36 25.98,27.99 26.86,27.99 27.77,27.08 27.99,27.08 29.21,25.86 29.21,24.92 30.02,24.11 30.53,24.11 30.71,24.28 32.84,22.15 32.86,22.15 34.36,20.64 v34.36,20.42 | v19.38,22.4 19.38,19.63 v16.76,17.02 | v32.41,8.51 v33.93,8.51
TIM2_CH4  (via drill 0.35)
  Top 0.254: v22.25,22.2 21.89,21.84 21.03,21.84 20.02,22.85 v20.02,23.11 | v24.38,22.1 24.79,22.5 U$1.PA3 | v24.21,21.23 24.77,20.67 v26.9,20.67 | v32.97,9.85 33.13,9.69 U$4.8 | v4.49,18.14 4.49,21.91 v4.52,21.93
  Bottom 0.254: 23.7,22.2 24.28,22.2 v24.38,22.1 | 23.7,22.2 v22.25,22.2 | 23.7,22.2 23.7,21.74 v24.21,21.23 | v26.9,20.67 27.61,19.96 27.61,17.35 26.52,16.26 26.52,11.05 27.71,9.85 v32.97,9.85 | v20.02,23.11 20,23.14 16.31,23.14 15.57,22.4 14.56,22.4 13.82,23.14 5.72,23.14 v4.52,21.93 | J3.6 2.54,16.19 v4.49,18.14
TIM3_CH2  (via drill 0.35)
  Top 0.254: U$1.PB5 28.57,30.84 28.57,27.31 27.26,26 27.26,24.84 25.8,23.38 24.84,23.38 24.36,22.9 23.33,22.9 | v20.93,23.37 21.03,23.37 21.5,22.9 23.33,22.9 | 23.33,22.9 22.94,22.5 22.94,19.85 21.94,18.86 21.94,17.6 21.99,17.54 21.99,7.86 22.26,7.59 U$6.6 | J2.4 3.05,25.75 3.2,25.6 4.1,25.6 7.05,22.65 7.32,22.65 v8.13,21.84
  Bottom 0.254: v8.13,21.84 8.41,22.12 12.78,22.12 12.95,21.95 12.95,16.76 13.72,16 18.03,16 19.79,17.76 19.79,21.53 20.46,22.2 20.59,22.2 20.93,22.54 v20.93,23.37
TIM3_CH3  (via drill 0.35)
  Top 0.203: v21.34,17.27 20.47,16.41
  Top 0.254: v29.41,21.34 29.21,21.54 U$1.PB0 | v22.71,18.36 24.39,18.36 25.49,19.46 27.92,19.46 28.51,18.88 28.51,18.77 28.84,18.44 29.19,18.44 29.67,18.91 v29.67,19.46 | v6.07,7.44 5.23,6.6 5.23,3.9 3.22,1.88 3.18,1.88 3.13,1.83 2.04,1.83 1.25,2.62 1.25,28.66 2.05,29.46 J2.5 | 20.47,16.41 20.47,15.82 21.26,15.03 U$6.7 21.26,5.67 v20.5,4.9
  Bottom 0.203: 6.2,7.44 v6.07,7.44
  Bottom 0.254: v29.67,19.46 29.21,19.92 29.21,21.14 v29.41,21.34 | v21.34,17.27 22.43,18.36 v22.71,18.36 | 6.2,7.44 6.59,7.83 15.51,7.83 18.45,4.9 v20.5,4.9
TIM3_CH4  (via drill 0.35)
  Top 0.254: v23.88,20.32 24.18,20.02 27.66,20.02 28.33,20.68 29.8,20.68 30.07,20.94 30.07,21.61 30.01,21.67 U$1.PB1 | U$6.8 20.26,15.1 19.82,15.55 19.82,17.26 21.19,18.64 21.19,19.87 20.71,20.34 | 20.71,20.34 19.84,20.34 19.82,20.32 19.79,20.34 19.15,20.34 18.67,19.86 14.56,19.86 13.85,20.58 13.85,20.69 12.75,21.78 12.75,22.83 13.54,23.61 13.54,24.23 12.92,24.85 10.37,24.85 9.91,25.31 9.91,27.13 8.99,28.04 6.97,28.04 5.09,29.92 4.31,29.92 3.55,30.68 3.08,30.68 3.04,30.72 3.05,30.73 J2.6 | 20.71,20.34 v22.28,20.34
  Bottom 0.203: v23.88,20.32 23.85,20.34 v22.28,20.34
TIM16_CH1  (via drill 0.35)
  Top 0.254: U$1.PA15 30.54,30.73 30.54,30.28 30.25,30 30.25,28.25 30.81,27.69 30.81,25.38 30.78,25.36 30.78,23.77 32.63,21.92 32.63,21.56 30.33,19.26 30.33,17.89 29.87,17.42 26.14,17.42 24.62,15.91 24.34,15.91 v23.68,15.25 | U$6.5 23.26,9.41 25.59,11.73 25.59,14.94 25.28,15.25 v23.68,15.25 | J2.3 3.05,23.57 4.03,22.59 4.84,22.59 7.17,20.26 v7.17,20.05 | v23.68,15.25 v23.67,15.24
  Bottom 0.254: v23.67,15.24 22.15,13.72 16.2,13.72 15.05,12.56 15.05,12.26 14.76,11.96 14.2,11.96 11.58,14.58 11.58,18.85 10.68,19.75 7.46,19.75 v7.17,20.05
TIM17_CH1  (via drill 0.35)
  Top 0.254: v30.9,20.91 30.26,20.27 28.83,20.27 28.45,19.89 v28.45,19.87 | U$3.8 47.79,8.68 48.39,9.27 48.39,16.2 48.33,16.26 48.33,18.02 v48.28,18.06 | v28.17,21.34 28.41,21.58 U$1.PA7
  Bottom 0.254: v28.17,21.34 28.17,19.87 v28.45,19.87 | v30.9,20.91 32.94,20.91 35.03,18.82 47.9,18.82 47.9,18.44 v48.28,18.06

### Text on the board
tNames: POWER LED | TIMER CHANNEL TEST POINTS | Akhilesh Prasad | Bryce Sasser | Katherine Sandys | Minh Nguyen | Rachel Livesay